# Altium project ENGG3800S2_DANCEMACHINE_REV2.PrjPcb (part 1 of 2)
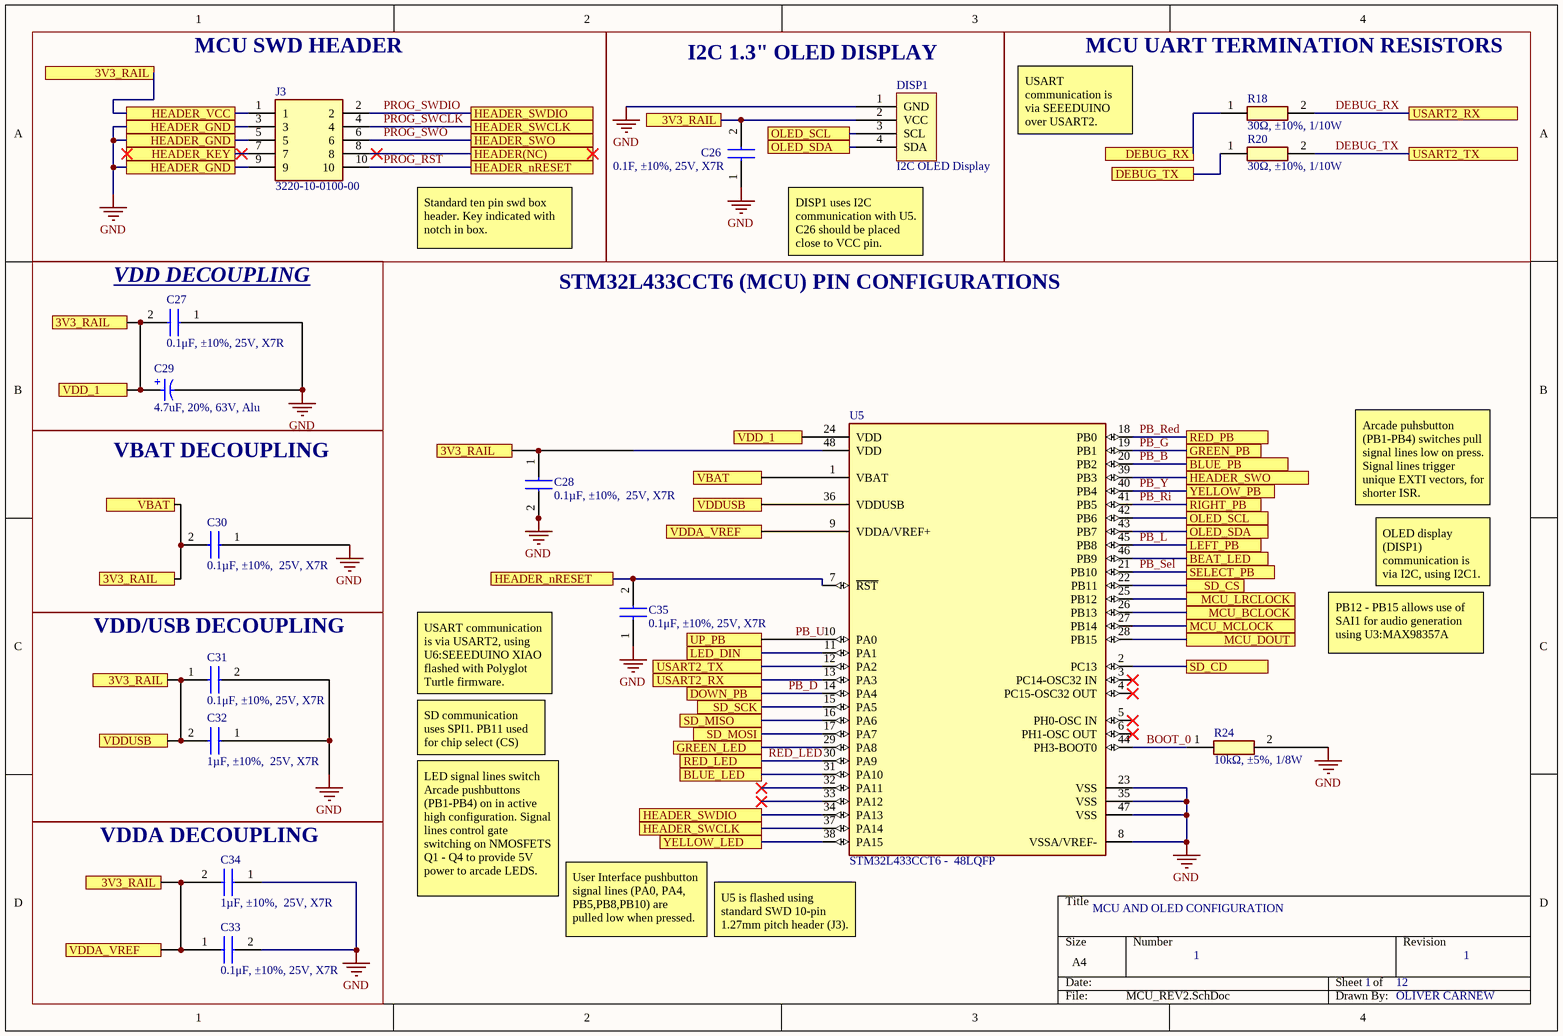
[diagram p0: MCU_REV2.SchDoc]
12 sheets, 293 parts. Net scope: flat (ports and power ports of the same name join across sheets).
Board file: PCB_DANCE_REV2.PcbDoc
Sheets:
  MCU_REV2.SchDoc
  POWER_BATT_REV2.SchDoc
  POWER_REV2.SchDoc
  3.3V_SUPPLY.SchDoc
  AUDIO_REV2.SchDoc
  SD_CARD_REV2.SchDoc
  INTERFACE_rev2.SchDoc
  ARCADE_BUTTONS.SchDoc
  TP_STD_PERIPHERALS.SchDoc
  CONNECTORS_WIRES.SchDoc
  LED_MATRIX.SchDoc
  WIRING_DIAGRAM.SchDoc

## Sheet MCU_REV2.SchDoc
size A4; SheetNumber: 1; SheetTotal: 11

### Parts
C26  0.1F, ±10%, 25V, X7R  [CAPC1005X55N]
C27  0.1μF, ±10%, 25V, X7R  [CAPC1005X55N]
C28  0.1µF, ±10%,  25V, X7R  [CAPC1005X55N]
C29  4.7uF, 20%, 63V, Alu  [WCAP-ATG5_D5H11]
C30  0.1µF, ±10%,  25V, X7R  [CAPC1005X55N]
C31  0.1μF, ±10%, 25V, X7R  [CAPC1005X55N]
C32  1µF, ±10%,  25V, X7R  [CAPC1608X90N]
C33  0.1μF, ±10%, 25V, X7R  [CAPC1005X55N]
C34  1µF, ±10%,  25V, X7R  [CAPC1608X90N]
C35  0.1μF, ±10%, 25V, X7R  [CAPC1005X55N]
DISP1  I2C OLED Display  [OLED_I2C_4pinHEADER]
J3  3220-10-0100-00  [322010010000]
R18  30Ω, ±10%, 1/10W  [RESC1608X55N]
R20  30Ω, ±10%, 1/10W  [RESC1608X55N]
R24  10kΩ, ±5%, 1/8W  [RESC2012X60N]
U5  STM32L433CCT6 -  48LQFP  [FP-LQFP48-5B-MFG]

### Blocks framed on the sheet
MCU SWD HEADER: J3
I2C 1.3" OLED DISPLAY: C26 DISP1
MCU UART TERMINATION RESISTORS: R18 R20
VDD DECOUPLING: C27 C29
VBAT DECOUPLING: C30
VDD/USB DECOUPLING: C31 C32
VDDA DECOUPLING: C33 C34

### Ports
3V3_RAIL, BEAT_LED, BLUE_LED, BLUE_PB, DEBUG_RX, DEBUG_TX, DOWN_PB, GREEN_LED, GREEN_PB, HEADER(NC), HEADER_GND, HEADER_KEY, HEADER_nRESET, HEADER_SWCLK, HEADER_SWDIO, HEADER_SWO, HEADER_VCC, LED_DIN, LEFT_PB, MCU_BCLOCK, MCU_DOUT, MCU_LRCLOCK, MCU_MCLOCK, OLED_SCL, OLED_SDA, RED_LED, RED_PB, RIGHT_PB, SD_CD, SD_CS, SD_MISO, SD_MOSI, SD_SCK, SELECT_PB, UP_PB, USART2_RX, USART2_TX, VBAT, VDD_1, VDDA_VREF, VDDUSB, YELLOW_LED, YELLOW_PB

### Nets
+3V3: C26.2 C27.2 C28.1 C29.1(P) C30.2 C31.1 C32.2 C33.1 C34.2 DISP1.2(VCC) J3.1 U5.1(VBAT) U5.9(VDDA/VREF+) U5.24(VDD) U5.36(VDDUSB) U5.48(VDD) ; port HEADER_VCC, port 3V3_RAIL, port VBAT, port VDDUSB, port VDDA_VREF, port VDD_1
GND: C26.1 C27.1 C28.2 C29.2(N) C30.1 C31.2 C32.1 C33.2 C34.1 C35.1 DISP1.1(GND) J3.3 J3.5 J3.9 R24.2 U5.8(VSSA/VREF-) U5.23(VSS) U5.35(VSS) U5.47(VSS) ; port HEADER_GND
BOOT_0: R24.1 U5.44(PH3-BOOT0)
DEBUG_RX: R18.2 U5.13(PA3) ; port USART2_RX
DEBUG_TX: R20.2 U5.12(PA2) ; port USART2_TX
LED_B: U5.31(PA10) ; port BLUE_LED
LED_G: U5.29(PA8) ; port GREEN_LED
LED_Y: U5.38(PA15) ; port YELLOW_LED
PB_B: U5.20(PB2) ; port BLUE_PB  [project net BLUE_PB]
PB_D: U5.14(PA4) ; port DOWN_PB
PB_G: U5.19(PB1) ; port GREEN_PB  [project net GREEN_PB]
PB_L: U5.45(PB8) ; port LEFT_PB
PB_Red: U5.18(PB0) ; port RED_PB
PB_Ri: U5.41(PB5) ; port RIGHT_PB
PB_Sel: U5.21(PB10) ; port SELECT_PB
PB_U: U5.10(PA0) ; port UP_PB
PB_Y: U5.40(PB4) ; port YELLOW_PB
PROG_RST: C35.2 J3.10 U5.7(~{RST}) ; port HEADER_nRESET
PROG_SWCLK: J3.4 U5.37(PA14) ; port HEADER_SWCLK
PROG_SWDIO: J3.2 U5.34(PA13) ; port HEADER_SWDIO
PROG_SWO: J3.6 U5.39(PB3) ; port HEADER_SWO
RED_LED: U5.30(PA9) ; port RED_LED  [project net LED_R]
SD_CD: U5.2(PC13) ; port SD_CD
SD_CS: U5.22(PB11) ; port SD_CS
SD_MISO: U5.16(PA6) ; port SD_MISO
SD_SCK: U5.15(PA5) ; port SD_SCK
NetDISP1_3: DISP1.3(SCL) U5.42(PB6) ; port OLED_SCL
NetDISP1_4: DISP1.4(SDA) U5.43(PB7) ; port OLED_SDA
NetJ3_7: J3.7 ; port HEADER_KEY
NetJ3_8: J3.8 ; port HEADER(NC)
NetJ4#1_2: U5.11(PA1) ; port LED_DIN
NetR18_1: R18.1 ; port DEBUG_RX
NetR20_1: R20.1 ; port DEBUG_TX
NetR23_2: U5.46(PB9) ; port BEAT_LED
NetR31_1: U5.17(PA7) ; port SD_MOSI
NetU3_1: U5.28(PB15) ; port MCU_DOUT
NetU3_14: U5.25(PB12) ; port MCU_LRCLOCK
NetU3_16: U5.26(PB13) ; port MCU_BCLOCK
NetU5_27: U5.27(PB14) ; port MCU_MCLOCK

Not connected (* = marked no-connect by the designer): U5 3(PC14-OSC32_IN)* 4(PC15-OSC32_OUT)* 5(PH0-OSC_IN)* 6(PH1-OSC_OUT)* 32(PA11)* 33(PA12)*

### Notes on the sheet
- USART communication is via SEEEDUINO over USART2.
- Standard ten pin swd box header. Key indicated with notch in box.
- DISP1 uses I2C communication with U5. C26 should be placed close to VCC pin.
- STM32L433CCT6 (MCU) PIN CONFIGURATIONS
- Arcade puhsbutton (PB1-PB4) switches pull signal lines low on press. Signal lines trigger unique EXTI vectors, for shorter ISR.
- OLED display (DISP1) communication is via I2C, using I2C1.
- PB12 - PB15 allows use of SAI1 for audio generation using U3:MAX98357A
- USART communication is via USART2, using U6:SEEEDUINO XIAO flashed with Polyglot Turtle firmware.
- SD communication uses SPI1. PB11 used for chip select (CS)
- LED signal lines switch Arcade pushbuttons (PB1-PB4) on in active high configuration. Signal lines control gate switching on NMOSFETS Q1 - Q4 to provide 5V power to arcade LEDS.
- MCU AND OLED CONFIGURATION
- User Interface pushbutton signal lines (PA0, PA4, PB5,PB8,PB10) are pulled low when pressed.
- (near U5) U5 is flashed using standard SWD 10-pin 1.27mm pitch header (J3).
- 1
- 12
- OLIVER CARNEW
- (in symbol CMP-03913-53914231-1) +

### Library data of the parts
C26-C28 C30 C31 C33 C35 = CL05B104KA5NNNC: Capacitor CAP CER 0.1UF 25V X7R 0402 CL05B104KA5NNNC; Manufacturer_Name: SAMSUNG; Datasheet Link: https://datasheet.datasheetarchive.com/originals/distributors/DKDS-19/372989.pdf; Height: 0.55mm; Manufacturer_Part_Number: CL05B104KA5NNNC; Mouser Part Number: 187-CL05B104KA5NNNC; Mouser Price/Stock: https://www.mouser.co.uk/ProductDetail/Samsung-Electro-Mechanics/CL05B104KA5NNNC?qs=Efv9o2T6U88DLyyMSzjXSQ%3D%3D; Arrow Part Number: CL05B104KA5NNNC; Arrow Price/Stock: https://www.arrow.com/en/products/cl05b104ka5nnnc/samsung-electro-mechanics?region=nac; Parameter 1: Capacitor CAP CER 0.1UF 25V X7R 0402 CL05B104KA5NNNC
C29 = CMP-03913-53914231-1: 860020672008 WCAP-ATG5 Aluminum Electrolytic Capacitors860020672008; Pitch: 2mm; Ripple Current: 32mA; Voltage Rating: 50V; Life (Hours): 2000hours; Leakage Current: 3µA; Capacitance: 4.7µF; Polarity: Polar; Min Operating Temperature: -40°C; Case/Package: Radial; Packaging: Tape & Box (TB); Tolerance: 20%; Height: 11mm; Lead Pitch: 2.0066mm; Diameter: 5mm; NexarPartId: 53914231; REACH SVHC: Unknown; Voltage Rating (DC): 50V; Mount: Through Hole; Height - Seated (Max): 12.4968mm; Length: 11mm; Max Operating Temperature: 105°C; RoHS: Compliant
C32 C34 = CL10B105KA8NNNC: Capacitor 1 µF ±10% 25V Ceramic Capacitor X7R 0603 (1608 Metric) CL10B105KA8NNNC; Manufacturer_Name: SAMSUNG; Datasheet Link: https://datasheet.datasheetarchive.com/originals/distributors/Datasheets-DGA10/2410489.pdf; Height: 0.9mm; Manufacturer_Part_Number: CL10B105KA8NNNC; Mouser Part Number: 187-CL10B105KA8NNNC; Mouser Price/Stock: https://www.mouser.co.uk/ProductDetail/Samsung-Electro-Mechanics/CL10B105KA8NNNC?qs=349EhDEZ59qp%252BMgnTol5Nw%3D%3D; Arrow Part Number: CL10B105KA8NNNC; Arrow Price/Stock: https://www.arrow.com/en/products/cl10b105ka8nnnc/samsung-electro-mechanics?region=nac; Parameter 1: 1 µF ±10% 25V Ceramic Capacitor X7R 0603 (1608 Metric)
DISP1 = OLED_I2C_4pinHEADER: OLED_I2C_4pinHEADER Large clear space
J3 = 3220-10-0100-00: Connector; Manufacturer_Name: CNC Tech; Datasheet Link: https://datasheet.datasheetarchive.com/originals/dk/DKDS-7/133059.pdf; Height: 5.6mm; Manufacturer_Part_Number: 3220-10-0100-00; Arrow Part Number: 3220-10-0100-00; Arrow Price/Stock: https://www.arrow.com/en/products/3220-10-0100-00/cnc-tech-llc?utm_currency=USD&region=nac
R18 R20 = ERJPA3F30R0V: Resistor ERJPA3F30R0V 30 Ohms ±1% 0.333W, 1/3W Chip Resistor 0603 (1608 Metric) Automotive AEC-Q200, Pulse Withstanding Thick Film; Manufacturer_Name: Panasonic; Datasheet Link: https://industrial.panasonic.com/cdbs/www-data/pdf/RDA0000/AOA0000C243.pdf; Height: 0.55mm; Manufacturer_Part_Number: ERJPA3F30R0V; Arrow Part Number: ERJPA3F30R0V; Arrow Price/Stock: https://www.arrow.com/en/products/erj-pa3f30r0v/panasonic; Parameter 1: Resistor ERJPA3F30R0V 30 Ohms ±1% 0.333W, 1/3W Chip Resistor 0603 (1608 Metric) Automotive AEC-Q200, Pulse Withstanding Thick Film
R24 = RC0805JR-0710KL: Resistor RES 10K OHM 5% 1/8W 0805  RC0805JR-0710KL; Manufacturer_Name: YAGEO; Datasheet Link: https://componentsearchengine.com/Datasheets/2/RC0805JR-0710KL.pdf; Height: 0.6mm; Manufacturer_Part_Number: RC0805JR-0710KL; Mouser Part Number: 603-RC0805JR-0710KL; Mouser Price/Stock: https://www.mouser.co.uk/ProductDetail/YAGEO/RC0805JR-0710KL?qs=ZFGQJeMQzF5q%2Fp77vM%2FrVQ%3D%3D; Arrow Part Number: RC0805JR-0710KL; Arrow Price/Stock: https://www.arrow.com/en/products/rc0805jr-0710kl/yageo?region=nac
U5 = CMP-12105-000047-1: IC MCU 32BIT 256KB FLASH 48LQFP; Manufacturer: STMicroelectronics; Max Junction Temp: +105°C; Min Supply Voltage: 1.55V; Number Of Uart Channels: 4; Number Of I2C Channels: 3; Max Supply Voltage: 3.6V; Number Of I/Os: 38; Number Of Usb Channels: 1; Memory Size: 256KBytes; Interface: I2C,SPI,UART,USART,CAN,USB,LIN,IrDA,SMBus,Other; Ram Size: 64KBytes; Standoff Height: 0.05mm; Number Of Pwm Channels: 14; Number Of Timers/Counters: 9; Frequency: 80MHz; Data Bus Width: 32bits; Number Of Adc Channels: 10; Core Architecture: Arm Cortex-M4; Digikey Description: IC MCU 32BIT 256KB FLASH 48LQFP; Category: IC; Ambient Temperature Range High: +85°C; Number Of Spi Channels: 3; Temperature Range High: +85°C; ComponentLink2Description: Datasheet; Device Class L3: Microcontrollers; Device Class L2: Embedded Processors and Controllers; Temperature Range Low: -40°C; Ambient Temperature Range Low: -40°C; Manufacturer Part Number: STM32L433CCT6; Automotive: No; Package: LQFP48-5B; Ipc Land Pattern Name: QFP50P900X900X160-48; RoHS: TRUE; Octopart: https://octopart.com/stm32l433cct6-stmicroelectronics-71093511; Number Of A/D Converters: 1; Memory Type: FLASH; Lead Free: Yes; ComponentLink2URL: https://www.st.com/resource/en/datasheet/stm32l433cc.pdf; Device Class L1: Integrated Circuits (ICs); Temperature: -40°C to +85°C; Number Of Cores: 1; Height: 1.6mm

## Sheet POWER_BATT_REV2.SchDoc
size A4; SheetNumber: 2; SheetTotal: 11
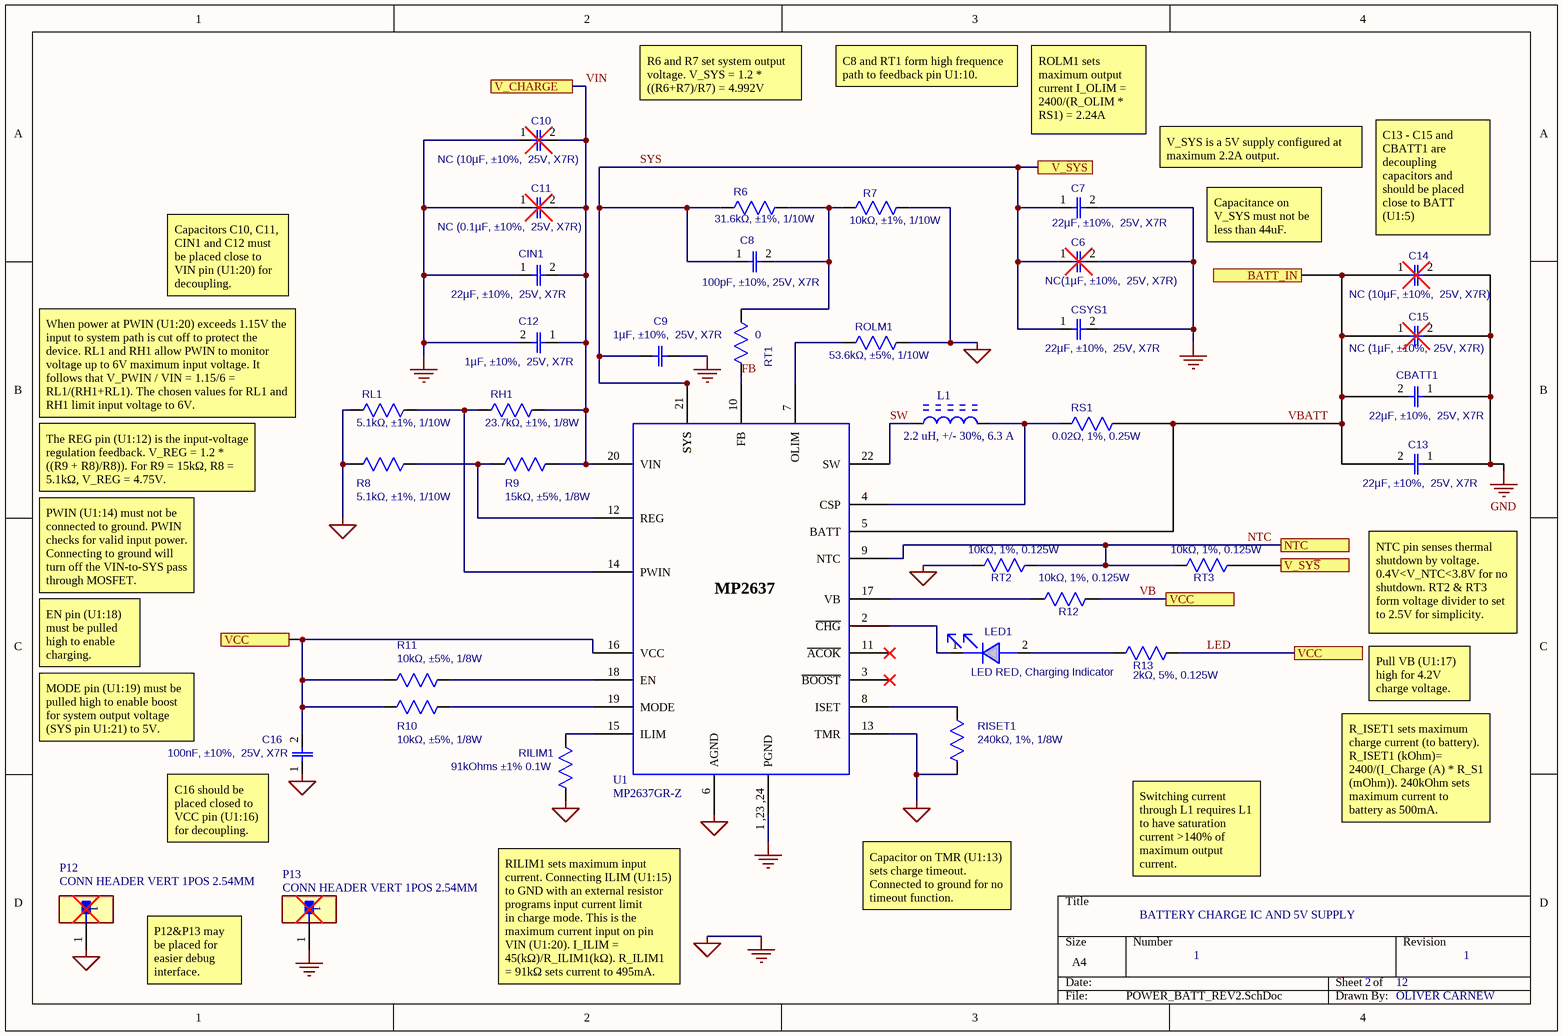
[diagram p1: POWER_BATT_REV2.SchDoc]

### Parts
(Parts that share a designator on the sheet are numbered #1, #2 ... from top to bottom, then left to right.)
*#1  NC  (value not drawn)
*#2  NC  (value not drawn)
*#3  NC  (value not drawn)
*?#1  NC  (value not drawn)
*?#2  NC  (value not drawn)
*?#3  NC  (value not drawn)
*?#4  NC  (value not drawn)
C6  NC(1µF, ±10%,  25V, X7R)  [CAP/0603]
C7  22µF, ±10%,  25V, X7R  [CAP/1206]
C8  100pF, ±10%, 25V, X7R  [CAP/0603]
C9  1µF, ±10%,  25V, X7R  [CAP/0603]
C10  NC (10µF, ±10%,  25V, X7R)  [CAP/0603]
C11  NC (0.1µF, ±10%,  25V, X7R)  [CAP/1206]
C12  1µF, ±10%,  25V, X7R  [CAP/0603]
C13  22µF, ±10%,  25V, X7R  [CAP/1206]
C14  NC (10µF, ±10%,  25V, X7R)  [CAP/0603]
C15  NC (1µF, ±10%,  25V, X7R)  [CAP/1206]
C16  100nF, ±10%,  25V, X7R  [CAP/0603]
CBATT1  22µF, ±10%,  25V, X7R  [CAP/1206]
CIN1  22µF, ±10%,  25V, X7R  [CAP/1206]
CSYS1  22µF, ±10%,  25V, X7R  [CAP/1206]
L1  2.2 uH, +/- 30%, 6.3 A  [BOUR-SRN8040_V]
LED1  LED RED, Charging Indicator  [LED/SMD/0805]
P12  CONN HEADER VERT 1POS 2.54MM  [FP-PH1-01-UA-MFG]
P13  CONN HEADER VERT 1POS 2.54MM  [FP-PH1-01-UA-MFG]
R6  31.6kΩ, ±1%, 1/10W  [RES/0603]
R7  10kΩ, ±1%, 1/10W  [RES/0603]
R8  5.1kΩ, ±1%, 1/10W  [RES/0603]
R9  15kΩ, ±5%, 1/8W  [RES/0603]
R10  10kΩ, ±5%, 1/8W  [RES/0603]
R11  10kΩ, ±5%, 1/8W  [RES/0603]
R12  10kΩ, 1%, 0.125W  [RES/0603]
R13  2kΩ, 5%, 0.125W  [RES/0603]
RH1  23.7kΩ, ±1%, 1/8W  [RES/0603]
RILIM1  91kOhms ±1% 0.1W  [RES/0603]
RISET1  240kΩ, 1%, 1/8W  [RES/0603]
RL1  5.1kΩ, ±1%, 1/10W  [RES/0603]
ROLM1  53.6kΩ, ±5%, 1/10W  [RES/0603]
RS1  0.02Ω, 1%, 0.25W  [RES/1206]
RT1  value 0  [RES/0603]  (hidden comment: RES/0603)
RT2  10kΩ, 1%, 0.125W  [RES/0603]
RT3  10kΩ, 1%, 0.125W  [RES/0603]
U1  MP2637GR-Z  [QFN24/4X4]

### Ports
BATT_IN, NTC, V_CHARGE, V_SYS, V_SY~{S}, VCC

### Nets
GND: C6.2 C7.2 C9.1 C10.1 C11.1 C12.2 C13.1 C14.2 C15.2 C16.1 CBATT1.1 CIN1.1 CSYS1.2 P12.1 P13.1 R7.1 R8.1 RILIM1.1 RISET1.1 RL1.1 ROLM1.1 RT2.2 U1.1_,23_,24(PGND) U1.6(AGND) U1.13(TMR)  [also labelled PGND]
FB: RT1.2 U1.10(FB)
LED: C16.2 R10.2 R11.2 R12.2 R13.1 U1.16(VCC) ; port VCC  [also labelled VB]
NTC: RT2.1 RT3.2 U1.9(NTC) ; port NTC
SW: L1.1 U1.22(SW)
SYS: C6.1 C7.1 C8.1 C9.2 CSYS1.1 R6.2 U1.21(SYS) U1.22(SYS) ; port V_SYS
VBATT: C13.2 C14.1 C15.1 CBATT1.2 RS1.1 U1.5(BATT) ; port BATT_IN  [project net V_BATT]
VIN: C10.2 C11.2 C12.1 CIN1.2 R9.2 RH1.2 U1.20(VIN) ; port V_CHARGE
NetC8_2: C8.2 R6.1 R7.2 RT1.1
NetL1_2: L1.2 RS1.2 U1.4(CSP)
NetLED1_1: LED1.1 U1.2(~{CHG})
NetLED1_2: LED1.2 R13.2
NetR8_2: R8.2 R9.1 U1.12(REG)
NetR10_1: R10.1 U1.19(MODE)
NetR11_1: R11.1 U1.18(EN)
NetR12_1: R12.1 U1.17(VB)
NetRH1_1: RH1.1 RL1.2 U1.14(PWIN)
NetRILIM1_2: RILIM1.2 U1.15(ILIM)
NetRISET1_2: RISET1.2 U1.8(ISET)
NetROLM1_2: ROLM1.2 U1.7(OLIM)
NetRT3_1: RT3.1 ; port V_SY~{S}

Not connected (* = marked no-connect by the designer): U1 3(~{BOOST})* 11(~{ACOK})*

### Notes on the sheet
- R6 and R7 set system output voltage. V_SYS = 1.2 * ((R6+R7)/R7) = 4.992V
- C8 and RT1 form high frequence path to feedback pin U1:10.
- ROLM1 sets maximum output current I_OLIM = 2400/(R_OLIM * RS1) = 2.24A
- V_SYS is a 5V supply configured at maximum 2.2A output.
- Capacitance on V_SYS must not be less than 44uF.
- C13 - C15 and CBATT1 are decoupling capacitors and should be placed close to BATT (U1:5)
- Capacitors C10, C11, CIN1 and C12 must be placed close to VIN pin (U1:20) for decoupling.
- When power at PWIN (U1:20) exceeds 1.15V the input to system path is cut off to protect the device. RL1 and RH1 allow PWIN to monitor voltage up to 6V maximum input voltage. It follows that V_PWIN / VIN = 1.15/6 = RL1/(RH1+RL1). The chosen values for RL1 and RH1 limit input voltage to 6V.
- The REG pin (U1:12) is the input-voltage regulation feedback. V_REG = 1.2 * ((R9 + R8)/R8)). For R9 = 15kΩ, R8 = 5.1kΩ, V_REG = 4.75V.
- PWIN (U1:14) must not be connected to ground. PWIN checks for valid input power. Connecting to ground will turn off the VIN-to-SYS pass through MOSFET.
- NTC pin senses thermal shutdown by voltage. 0.4V<V_NTC<3.8V for no shutdown. RT2 & RT3 form voltage divider to set to 2.5V for simplicity.
- EN pin (U1:18) must be pulled high to enable charging.
- Pull VB (U1:17) high for 4.2V charge voltage.
- MODE pin (U1:19) must be pulled high to enable boost for system output voltage (SYS pin U1:21) to 5V.
- (near C16) C16 should be placed closed to VCC pin (U1:16) for decoupling.
- R_ISET1 sets maximum charge current (to battery). R_ISET1 (kOhm)= 2400/(I_Charge (A) * R_S1 (mOhm)). 240kOhm sets maximum current to battery as 500mA.
- Capacitor on TMR (U1:13) sets charge timeout. Connected to ground for no timeout function.
- Switching current through L1 requires L1 to have saturation current >140% of maximum output current.
- BATTERY CHARGE IC AND 5V SUPPLY
- P12&P13 may be placed for easier debug interface.
- RILIM1 sets maximum input current. Connecting ILIM (U1:15) to GND with an external resistor programs input current limit
  in charge mode. This is the maximum current input on pin VIN (U1:20). I_ILIM = 45(kΩ)/R_ILIM1(kΩ). R_ILIM1 = 91kΩ sets current to 495mA.
- 1
- 2
- 12
- OLIVER CARNEW

### Library data of the parts
C6 = 07.0043: Ceramic Capacitor;16V;X7R;0603;; Manufacturer: {Manufacturer}; Manufacturer P/N: {Manufacturer P/N}; Part_Name: GRM188R71C105KA12D; Manufacture: muRata; Pid: 1505; Out_Num: 0; Available_Num: 5801; Note: 1uF/16V; Package: 0603; Part Number: 07.0043; Spec: Ceramic Capacitor; Manufacture_PN: GRM188R71C105KA12D; Stock_Num: 5801
C7 C15 CSYS1 = 07.0581: Ceramic Capacitor;10V;X7R;1206; Manufacturer: {Manufacturer}; Manufacturer P/N: {Manufacturer P/N}; Part_Name: GRM31CR71A226KE15L; Manufacture: muRata; Pid: 2003; Out_Num: 0; Available_Num: 1278; Note: 22uF/10V/1206; Package: 1206; Part Number: 07.0581; Spec: Ceramic Capacitor; Manufacture_PN: GRM31CR71A226KE15L; Stock_Num: 1278
C8 = 07.0138: Ceramic Capacitor;50V;C0G;0603; 100pF; Manufacturer: {Manufacturer}; Manufacturer P/N: {Manufacturer P/N}; Part_Name: C1608C0G1H470J; Manufacture: TDK; Pid: 1600; Out_Num: 0; Available_Num: 5335; Note: 47pF/50V; Package: 0603; Part Number: 07.0138; Spec: Ceramic Capacitor; Manufacture_PN: C1608C0G1H470J; Stock_Num: 5335
C9 = 07.0043: Ceramic Capacitor;16V;X7R;0603;; Manufacturer: {Manufacturer}; Manufacturer P/N: {Manufacturer P/N}; Part_Name: GRM188R71C105KA12D; Manufacture: muRata; Pid: 680; Out_Num: 0; Available_Num: 2297; Package: 0603; Part Number: 07.0043; Spec: Ceramic Capacitor; Manufacture_PN: GRM188R71C105KA12D; Stock_Num: 2297
C10 = 07.0772: Ceramic Capacitor;25V;X7R; Manufacturer: {Manufacturer}; Manufacturer P/N: {Manufacturer P/N}; Part_Name: C1608X7R1E105K; Manufacture: TDK; Pid: 2193; Out_Num: 310; Available_Num: 2930; Note: 1uF/25V; Package: 0603; Part Number: 07.0772; Spec: Ceramic Capacitor; Manufacture_PN: C1608X7R1E105K; Stock_Num: 3240
C11 CIN1 = 07.0752: Ceramic Capacitor;25V;X5R;; Manufacturer: {Manufacturer}; Manufacturer P/N: {Manufacturer P/N}; Part_Name: GRM31CR61E226KE15; Manufacture: Murata; Pid: 2173; Out_Num: 260; Available_Num: 1967; Note: 22uF/25V/1206; Package: 1206; Part Number: 07.0752; Spec: Ceramic Capacitor; Manufacture_PN: GRM31CR61E226KE15; Stock_Num: 2227
C12 = 07.0772: Ceramic Capacitor;25V;X7R; Manufacturer: {Manufacturer}; Manufacturer P/N: {Manufacturer P/N}; Part_Name: C1608X7R1E105K; Manufacture: TDK; Pid: 2193; Out_Num: 0; Note: 1uF/25V; Package: 0603; Part Number: 07.0772; Spec: Ceramic Capacitor; Manufacture_PN: C1608X7R1E105K; Stock_Num: 0; Available_Num: 0
C13 = 07.0581: Ceramic Capacitor;10V;X7R;1206; 22µF, ±10%,  25V, X7R; Manufacturer: {Manufacturer}; Manufacturer P/N: {Manufacturer P/N}; Part_Name: GRM31CR71A226KE15L; Manufacture: muRata; Pid: 1170; Out_Num: 0; Available_Num: 1278; Package: 1206; Part Number: 07.0581; Spec: Ceramic Capacitor; Manufacture_PN: GRM31CR71A226KE15L; Stock_Num: 1278
C14 = 07.0043: Ceramic Capacitor;16V;X7R;0603; NC (22µF, ±10%,  25V, X7R); Manufacturer: {Manufacturer}; Manufacturer P/N: {Manufacturer P/N}; Part_Name: GRM188R71C105KA12D; Manufacture: muRata; Pid: 1505; Out_Num: 0; Available_Num: 5801; Note: 1uF/16V; Package: 0603; Part Number: 07.0043; Spec: Ceramic Capacitor; Manufacture_PN: GRM188R71C105KA12D; Stock_Num: 5801
C16 = 07.0053: Ceramic Capacitor;16V;X7R;0603;100nF, ±10%,  25V, X7R; Manufacturer: {Manufacturer}; Manufacturer P/N: {Manufacturer P/N}; Part_Name: GRM188R71C104KA01D; Manufacture: muRata; Pid: 1515; Out_Num: 1670; Available_Num: 848; Note: 100nF/16V; Package: 0603; Part Number: 07.0053; Spec: Ceramic Capacitor; Manufacture_PN: GRM188R71C104KA01D; Stock_Num: 2518
CBATT1 = 07.0581: Ceramic Capacitor;10V;X7R;1206; Manufacturer: {Manufacturer}; Manufacturer P/N: {Manufacturer P/N}; Part_Name: GRM31CR71A226KE15L; Manufacture: muRata; Pid: 1170; Out_Num: 0; Available_Num: 1278; Package: 1206; Part Number: 07.0581; Spec: Ceramic Capacitor; Manufacture_PN: GRM31CR71A226KE15L; Stock_Num: 1278
L1 = CMP-2000-07144-1: Semi-Shielded Power Inductor, 2.2 uH, +/- 30%, 6.3 A, -40 to 125 degC, 2-Pin SMD, RoHS, Tape and Reel SRN8040-2R2Y; Manufacturer: Bourns; Brand/Series: SRN8040Series; Current, Rating: 6.3A; Inductance: 2.2μH; Type: Power; Datasheet Version: 05/2015; Mounting Technology: SurfaceMount; Tolerance: ±30%; Datasheet URL: http://www.bourns.com/docs/Product-Datasheets/SRN8040.pdf; Package Reference: SRN8040; Termination: SMD; Manufacturer URL: http://www.bourns.com/; Package Description: 2-Pin Surface Mounted Device, Body 8 x 8 mm
LED1 = 19.0003: LED;ºì¹â; LED/SMD/0805; Manufacturer P/N: {Manufacturer P/N}; Manufacturer: {Manufacturer}; Manufacture: BRIGHT LED; Value: BL-HUF35A-TRB; Pid: 37; Out_Num: 0; Available_Num: 1960; Package: 0805; Part Number: 19.0003; Spec: LED; Part_Name: BL-HUF35A-TRB; Manufacture_PN: BL-HUF35A-TRB; Stock_Num: 1960
P12 P13 = CMP-42765-000003-1: CONN HEADER VERT 1POS 2.54MM PH1-01-UA; Number of Positions: 1; Voltage Rating (AC): 250V; Insulation Material: PBT; Number of Rows: 1; Connector Type: Header; Min Operating Temperature: -40°C; Packaging: Bulk; Contact Material: Brass; Mount: Through Hole; Contact Shape: Square; Contact Finish - Mating: GOLD; Series: PH1; Contact Type: Male Pin; Termination: Solder; Flammability Rating: UL94 V-0; Insulation Color: Black; Lead Free: Lead Free; Fastening Type: Pull; Max Operating Temperature: 105°C
R6 = 06.0160: Film Resistor;1%;; Manufacturer: Yageo; Manufacturer P/N: 9C06031A1203FKHFT; Part_Name: RC0603FR-0731K6L; Pid: 2840; Out_Num: 0; Available_Num: 4254; Note: 31.6k/1%; Distributor: Digikey; Package: 0603; Distributor P/N: 311-120KHCT-ND; Part Number: 06.0160; Spec: Film Resistor; Manufacture: Yageo; Manufacture_PN: RC0603FR-0731K6L; Stock_Num: 4254
R7 = 06.0112: Film Resistor;1%;; Manufacturer: Yageo; Manufacturer P/N: 9C06031A1203FKHFT; Part_Name: RC0603FR-0710KL; Pid: 2792; Out_Num: 2310; Available_Num: 7415; Note: 10k/1%; Distributor: Digikey; Package: 0603; Distributor P/N: 311-120KHCT-ND; Part Number: 06.0112; Spec: Film Resistor; Manufacture: Yageo; Manufacture_PN: RC0603FR-0710KL; Stock_Num: 9725
R8 RL1 = 06.0691: Film Resistor;1%;; Manufacturer: Yageo; Manufacturer P/N: 9C06031A1203FKHFT; Part_Name: RC0603FR-075K1L; Pid: 3353; Out_Num: 0; Available_Num: 5749; Note: 5.1k/1%; Distributor: Digikey; Package: 0603; Distributor P/N: 311-120KHCT-ND; Part Number: 06.0691; Spec: Film Resistor; Manufacture: Yageo; Manufacture_PN: RC0603FR-075K1L; Stock_Num: 5749
R9 = 06.0129: Film Resistor;1%;; Manufacturer: Yageo; Manufacturer P/N: 9C06031A1203FKHFT; Part_Name: RC0603FR-0715KL; Pid: 2809; Out_Num: 160; Available_Num: 3939; Note: 15k/1%; Distributor: Digikey; Package: 0603; Distributor P/N: 311-120KHCT-ND; Part Number: 06.0129; Spec: Film Resistor; Manufacture: Yageo; Manufacture_PN: RC0603FR-0715KL; Stock_Num: 4099
R10 = 06.0284: Film Resistor;5%;; Manufacturer: Yageo; Manufacturer P/N: 9C06031A1203FKHFT; Part_Name: RC0603JR-0710K; Pid: 2947; Out_Num: 0; Available_Num: 6218; Note: 10k; Distributor: Digikey; Package: 0603; Distributor P/N: 311-120KHCT-ND; Part Number: 06.0284; Spec: Film Resistor; Manufacture: Yageo; Manufacture_PN: RC0603JR-0710K; Stock_Num: 6218
R11 = 06.0284: Manufacturer: Yageo; Manufacturer P/N: 9C06031A1203FKHFT; Part_Name: RC0603JR-0710K; Pid: 2947; Spec: Film Resistor; Out_Num: 0; Available_Num: 6218; Note: 10k; Distributor: Digikey; Package: 0603; Distributor P/N: 311-120KHCT-ND; Part Number: 06.0284; Manufacture: Yageo; Manufacture_PN: RC0603JR-0710K; Stock_Num: 6218
R12 = 06.0284: Film Resistor;5%; 10kΩ, 1%, 0.125W; 0603; Manufacturer: Yageo; Manufacturer P/N: 9C06031A1203FKHFT; Part_Name: RC0603JR-0710K; Pid: 2947; Out_Num: 0; Available_Num: 6218; Note: 10k; Distributor: Digikey; Package: 0603; Distributor P/N: 311-120KHCT-ND; Part Number: 06.0284; Spec: Film Resistor; Manufacture: Yageo; Manufacture_PN: RC0603JR-0710K; Stock_Num: 6218
R13 = 06.0015: Film Resistor;5%;1/10W; 5kΩ, 5%, 0.125W 0603; Manufacturer: Yageo; Manufacturer P/N: 9C06031A1203FKHFT; Part_Name: CR0603JA0202G; Manufacture: LIZ; Pid: 2695; Out_Num: 0; Available_Num: 3523; Note: 2K; Distributor: Digikey; Package: 0603; Distributor P/N: 311-120KHCT-ND; Part Number: 06.0015; Spec: Film Resistor; Manufacture_PN: CR0603JA0202G; Stock_Num: 3523
RH1 = 06.0148: Film Resistor;1%; Manufacturer: Yageo; Manufacturer P/N: 9C06031A1203FKHFT; Part_Name: RC0603FR-0723K7L; Pid: 2828; Out_Num: 0; Available_Num: 7686; Note: 23.7k/1%; Distributor: Digikey; Package: 0603; Distributor P/N: 311-120KHCT-ND; Part Number: 06.0148; Spec: Film Resistor; Manufacture: Yageo; Manufacture_PN: RC0603FR-0723K7L; Stock_Num: 7686
RILIM1 = 06.0129: 91 kOhms ±1% 0.1W, 1/10W Chip Resistor 0603 (1608 Metric) Anti-Sulfur Thin FilmMCT06030C9102FP500; Manufacturer: Yageo; Manufacturer P/N: 9C06031A1203FKHFT; Part_Name: RC0603FR-0715KL; Value: 15K 1%; Pid: 2809; Spec: Film Resistor; Out_Num: 0; Available_Num: 1229; Note: 15k/1%; Distributor: Digikey; Package: 0603; Distributor P/N: 311-120KHCT-ND; Part Number: 06.0129; Manufacture: Yageo; Manufacture_PN: RC0603FR-0715KL; Stock_Num: 1229
RISET1 = 06.0177: Film Resistor;1%; 240kΩ, 1%, 1/8W; Manufacturer: Yageo; Manufacturer P/N: 9C06031A1203FKHFT; Part_Name: RC0603FR-0747K5L; Pid: 2857; Out_Num: 0; Available_Num: 7700; Note: 47.5k/1%; Distributor: Digikey; Package: 0603; Distributor P/N: 311-120KHCT-ND; Part Number: 06.0177; Spec: Film Resistor; Manufacture: Yageo; Manufacture_PN: RC0603FR-0747K5L; Stock_Num: 7700
ROLM1 = 06.0182: Film Resistor;1%; Manufacturer: Yageo; Manufacturer P/N: 9C06031A1203FKHFT; Part_Name: RC0603FR-0753K6L; Pid: 2862; Out_Num: 0; Available_Num: 9040; Note: 53.6k/1%; Distributor: Digikey; Package: 0603; Distributor P/N: 311-120KHCT-ND; Part Number: 06.0182; Spec: Film Resistor; Manufacture: Yageo; Manufacture_PN: RC0603FR-0753K6L; Stock_Num: 9040
RS1 = 06.0564: Film Resistor;1%; RES 0.02 OHM 1% 1/4W 1206; WSL1206R0200FEA; Manufacturer: Yageo; Manufacturer P/N: 9C06031A1203FKHFT; Part_Name: WSL1206-18; Manufacture: Vishay; Pid: 3227; Out_Num: 0; Available_Num: 291; Note: 20m/1%/1206; Distributor: Digikey; Package: 1206; Distributor P/N: 311-120KHCT-ND; Part Number: 06.0564; Spec: Film Resistor; Manufacture_PN: WSL1206-18; Stock_Num: 291
RT1 = 06.0039: Film Resistor;5%;; Manufacturer: Yageo; Manufacturer P/N: 9C06031A1203FKHFT; Part_Name: RC0603JR-070RL; Pid: 2719; Out_Num: 4670; Available_Num: 14667; Distributor: Digikey; Package: 0603; Distributor P/N: 311-120KHCT-ND; Part Number: 06.0039; Spec: Film Resistor; Manufacture: Yageo; Manufacture_PN: RC0603JR-070RL; Stock_Num: 19337; Note: 0
RT2 = 06.0112: Film Resistor;1%; 10kΩ, 1%, 0.125W; 0603; Manufacturer: Yageo; Manufacturer P/N: 9C06031A1203FKHFT; Part_Name: RC0603FR-0710KL; Pid: 2792; Out_Num: 2110; Available_Num: 16838; Note: 10k/1%; Distributor: Digikey; Package: 0603; Distributor P/N: 311-120KHCT-ND; Part Number: 06.0112; Spec: Film Resistor; Manufacture: Yageo; Manufacture_PN: RC0603FR-0710KL; Stock_Num: 18948
RT3 = 06.0112: Film Resistor;1%; 10kΩ, 1%, 0.125W;0603; Manufacturer: Yageo; Manufacturer P/N: 9C06031A1203FKHFT; Part_Name: RC0603FR-0710KL; Pid: 2792; Out_Num: 2110; Available_Num: 16838; Note: 10k/1%; Distributor: Digikey; Package: 0603; Distributor P/N: 311-120KHCT-ND; Part Number: 06.0112; Spec: Film Resistor; Manufacture: Yageo; Manufacture_PN: RC0603FR-0710KL; Stock_Num: 18948
U1 = MP2637

## Sheet POWER_REV2.SchDoc
size A4; SheetNumber: 3; SheetTotal: 11; SPICEModelCacheNVXGRYFH: <root> / <DocumentId>NVXGRYFH</DocumentId> / </root>
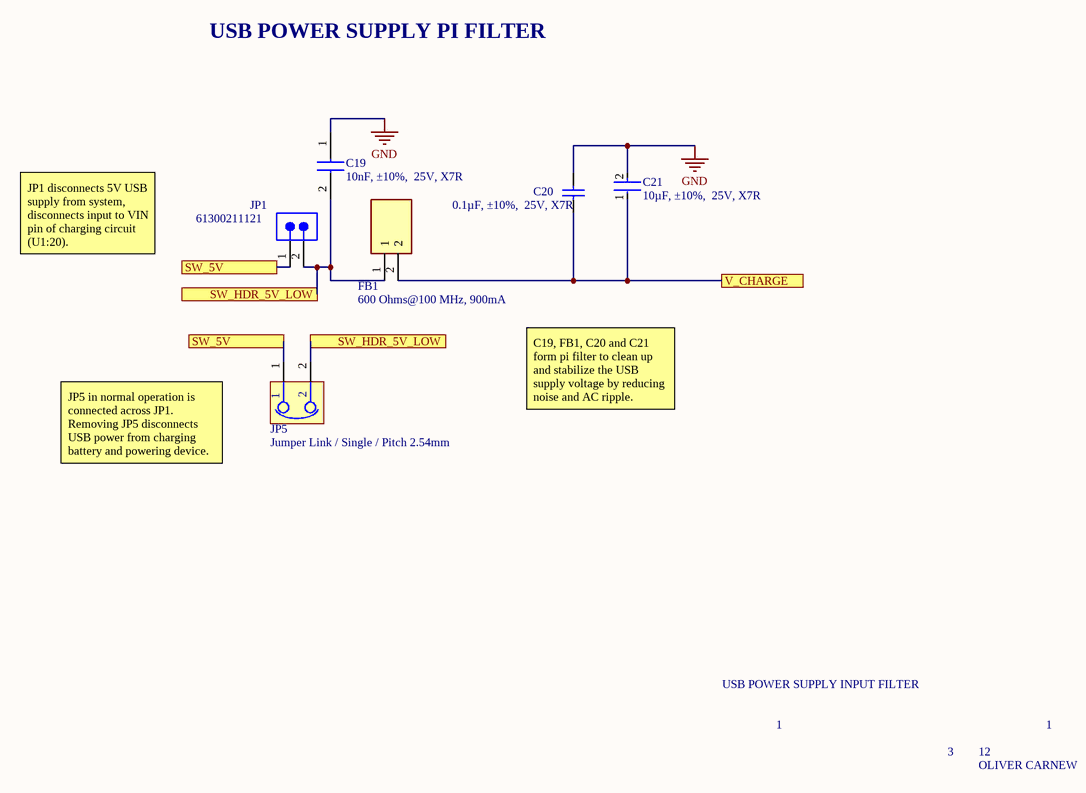
[diagram p2: POWER_REV2.SchDoc]

### Parts
C19  10nF, ±10%,  25V, X7R  [C0603]
C20  0.1µF, ±10%,  25V, X7R  [CAPC1608X90X35ML10T15]
C21  10µF, ±10%,  25V, X7R  [FP-CL21B106KOQNNNE-MFG]
FB1  600 Ohms@100 MHz, 900mA  [BEADC1608X90N]
JP1  61300211121  [61300211121]
JP5  Jumper Link / Single / Pitch 2.54mm

### Ports
SW_5V, SW_HDR_5V_LOW, V_CHARGE

### Nets
GND: C19.1 C20.2 C21.2
VIN: C20.1 C21.1 FB1.2 ; port V_CHARGE
NetC19_2: C19.2 FB1.1 JP1.2 JP5.2 ; port SW_HDR_5V_LOW
NetJP1_1: JP1.1 JP5.1 ; port SW_5V

### Notes on the sheet
- USB POWER SUPPLY PI FILTER
- JP1 disconnects 5V USB supply from system, disconnects input to VIN pin of charging circuit (U1:20).
- C19, FB1, C20 and C21 form pi filter to clean up and stabilize the USB supply voltage by reducing noise and AC ripple.
- JP5 in normal operation is connected across JP1. Removing JP5 disconnects USB power from charging battery and powering device.
- USB POWER SUPPLY INPUT FILTER
- 1
- 3
- 12
- OLIVER CARNEW

### Library data of the parts
C19 = C0603C103K4RECTU: Capacitor 10000 pF ±10% 16V Ceramic Capacitor X7R 0603 (1608 Metric) ETSG 64-12-01 C0603C103K4RECTU; Manufacturer_Name: KEMET; Datasheet Link: https://content.kemet.com/datasheets/KEM_C1090_X7R_ESD.pdf; Height: 0.87mm; Manufacturer_Part_Number: C0603C103K4RECTU; Mouser Part Number: 80-C0603C103K4RECTU; Mouser Price/Stock: https://www.mouser.co.uk/ProductDetail/KEMET/C0603C103K4RECTU?qs=55YtniHzbhDzGaFFpCm8vg%3D%3D; Arrow Part Number: C0603C103K4RECTU; Arrow Price/Stock: https://www.arrow.com/en/products/c0603c103k4rectu/kemet-corporation?region=nac
C20 = CMP-2100-03643-1: Chip Capacitor, 0.1 uF, +/- 10%, 50 V, -55 to 125 degC, 0603 (1608 Metric), RoHS, Tape and Reel; Manufacturer: Murata; Dielectric Material: Ceramic; Voltage Rating: 50V; Capacitance: 100nF; Insulation Resistance: 10GR; Case Code (Metric): 1608; Lead Free: LeadFree; Depth: 0.8mm; Number of Pins: 2; Radiation Hardening: No; Case/Package: 0603; Manufacturer URL: http://www.murata.com/; Packaging: TapeandReel; Length: 1.6mm; Contact Plating: Tin; Datasheet URL: http://psearch.en.murata.com/capacitor/product/GRM188R71H104KA93%23.pdf; Tolerance: 10%; Case Code (Imperial): 0603; Min Operating Temperature: -55degC; RoHSCompliant: true; Voltage: 50V; Termination: SMD/SMT; Mount: SurfaceMount; Material: Ceramic; Package Quantity: 1; Dielectric: X7R; Height: 0.8mm; Thickness: 0.035inch; REACH SVHC: NoSVHC; Max Operating Temperature: 125degC; Width: 0.8mm; Package Reference: 0603; Voltage Rating (DC): 50V; Datasheet Version: 42675.0; Package Description: 2-Pin Surface Mount Device, Body 1.6 x 0.8 mm
C21 = CMP-2000-06106-2: CAP CER 10UF 16V X7R 0805 CL21B106KOQNNNE; Manufacturer: Samsung Electro-Mechanics America, Inc; Material: Ceramic; Temperature Coefficient: 15%; Digikey Description: CAP CER 10UF 16V X7R 0805; Lead Free: Yes; ComponentLink2URL: http://www.samsungsem.com/servlet/FileDownload?path=productsearch&sname=CL21B106KOQNNNE.pdf&oname=CL21B106KOQNNNE.pdf; ComponentLink2Description: Datasheet; Temperature Range Low: -55°C; RoHS: TRUE; Category: Cap; Temperature Characteristic: X7R; Manufacturer Part Number: CL21B106KOQNNNE; Automotive: No; Octopart: https://octopart.com/cl21b106koqnnne-samsung-19832289; Device Class L3: Ceramic Capacitors; Temperature Range High: +125°C; Height: 1.4mm; Device Class L2: Capacitors; Voltage Rating: 16V; Value: 10uF; Temperature: -55°C to +125°C; Tolerance: 10%; Device Class L1: Passive Components; Ipc Land Pattern Name: CAPC200125X125; Package: CL21B106KOQNNNE; Capacitance: 10uF
FB1 = FBMH1608HM601-T: 600 Ohms @ 100 MHz 1 Power Line Ferrite Bead 0603 (1608 Metric) 900mA 170mOhm; Manufacturer_Name: TAIYO YUDEN; Datasheet Link: https://componentsearchengine.com/Datasheets/2/FBMH1608HM601-T.pdf; Height: 0.9mm; Manufacturer_Part_Number: FBMH1608HM601-T; Mouser Part Number: 963-FBMH1608HM601-T; Mouser Price/Stock: https://www.mouser.co.uk/ProductDetail/TAIYO-YUDEN/FBMH1608HM601-T?qs=I6KAKw0tg2y6O4cu0afp%252BA%3D%3D; Arrow Part Number: FBMH1608HM601-T; Arrow Price/Stock: https://www.arrow.com/en/products/fbmh1608hm601-t/taiyo-yuden
JP1 = CMP-1712-00002-6: NexarPartId: 20081794; Number of Contacts: 2; Pitch: 2.54mm; Connector Type: Male Pin; Voltage Rating: 250V; Current Rating: 3A; Gender: Male; Contact Resistance: 20mΩ; Height: 8.94mm; Lead Free: Lead Free; Number of Pins: 2; Termination: Through Hole; RoHS: Compliant; Lead Pitch: 2.54mm; REACH SVHC: No SVHC; Housing Material: PBT; Contact Mating Length: 5.9944mm; Min Operating Temperature: -40°C; Orientation: Vertical; Contact Material: Copper; Contact Gender: Male; Max Operating Temperature: 125°C; Number of Rows: 1; Number of Positions: 2; Packaging: Bulk; Contact Plating: Gold; Mount: Through Hole; Color: Black; Operating Supply Voltage: 250V
JP5 = jumper_2.54mm: CONNECTOR : PCB Jumper Link / Single / Pitch 2.54mm / Black /shunt.  01-96-02

## Sheet 3.3V_SUPPLY.SchDoc
size A4; SheetNumber: 4; SheetTotal: 11
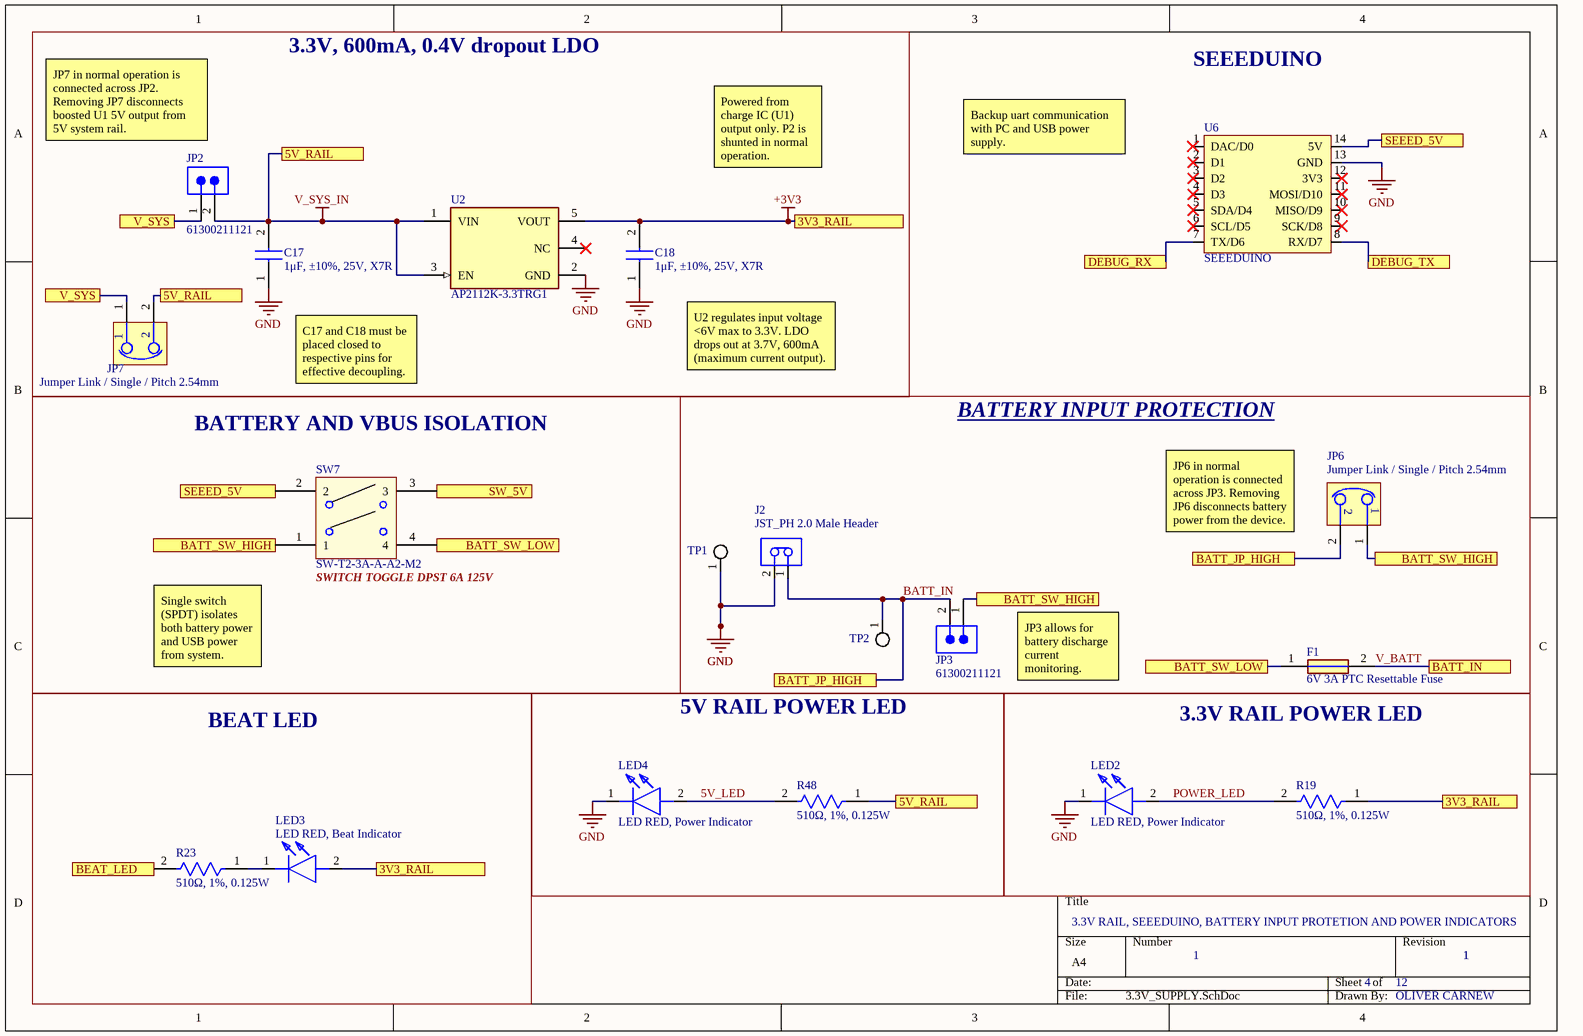
[diagram p3: 3.3V_SUPPLY.SchDoc]

### Parts
(Parts that share a designator on the sheet are numbered #1, #2 ... from top to bottom, then left to right.)
C17  1μF, ±10%, 25V, X7R  [CAPC1608X90N]
C18  1μF, ±10%, 25V, X7R  [CAPC1608X90N]
F1  6V 3A PTC Resettable Fuse  [FUSC4632X155N]
J2#1  JST_PH 2.0 Male Header  [JST-B2B-PH-K-S_V]
JP2  61300211121  [61300211121]
JP3  61300211121  [61300211121]
JP6  Jumper Link / Single / Pitch 2.54mm
JP7  Jumper Link / Single / Pitch 2.54mm
LED2  LED RED, Power Indicator  [LEDC2012X90N]
LED3  LED RED, Beat Indicator  [LEDC2012X90N]
LED4  LED RED, Power Indicator  [LEDC2012X90N]
R19  510Ω, 1%, 0.125W  [FP-CRCW0805-e3-IPC_B]
R23  510Ω, 1%, 0.125W  [FP-CRCW0805-e3-IPC_B]
R48  510Ω, 1%, 0.125W  [FP-CRCW0805-e3-IPC_B]
SW7  SW-T2-3A-A-A2-M2  [SWITCH_PCB_MOUNT]
TP1  Small testpoint 40mil  [TEST_POINT_SMALL]  (value not drawn)
TP2  Small testpoint 40mil  [TEST_POINT_SMALL]  (value not drawn)
U2  AP2112K-3.3TRG1  [FP-SOT25-MFG]
U6  SEEEDUINO  [XIAO - 6mm annular]

### Blocks framed on the sheet
3.3V, 600mA, 0.4V dropout LDO: C17 C18 JP2 JP7 U2
BATTERY AND VBUS ISOLATION: SW7
BATTERY INPUT PROTECTION: F1 J2#1 JP3 JP6 TP1 TP2
BEAT LED: LED3 R23
5V RAIL POWER LED: LED4 R48
3.3V RAIL POWER LED: LED2 R19

### Ports
3V3_RAIL, 5V_RAIL, BATT_IN, BATT_JP_HIGH, BATT_SW_HIGH, BATT_SW_LOW, BEAT_LED, DEBUG_RX, DEBUG_TX, SEEED_5V, SW_5V, V_SYS

### Nets
+3V3: C18.2 LED3.2(A) R19.1 U2.5(VOUT) ; port 3V3_RAIL
GND: C17.1 C18.1 J2#1.2 LED2.1(K) LED4.1(K) TP1.1 U2.2(GND) U6.13(GND)
V_SYS_IN: C17.2 JP2.2 JP7.2 R48.1 U2.1(VIN) U2.3(EN) ; port 5V_RAIL
5V_LED: LED4.2(A) R48.2
BATT_IN: J2#1.1 JP3.2 JP6.2 TP2.1 ; port BATT_JP_HIGH
POWER_LED: LED2.2(A) R19.2
SYS: JP2.1 JP7.1 ; port V_SYS
V_BATT: F1.2 ; port BATT_IN
NetF1_1: F1.1 SW7.4 ; port BATT_SW_LOW
NetJP1_1: SW7.3 ; port SW_5V
NetJP3_1: JP3.1 JP6.1 SW7.1 ; port BATT_SW_HIGH
NetLED3_1: LED3.1(K) R23.1
NetR18_1: U6.7(TX/D6) ; port DEBUG_RX
NetR20_1: U6.8(RX/D7) ; port DEBUG_TX
NetR23_2: R23.2 ; port BEAT_LED
NetSW7_2: SW7.2 U6.14(5V) ; port SEEED_5V

Not connected (* = marked no-connect by the designer): U2 4(NC)*; U6 1(DAC/D0)* 2(D1)* 3(D2)* 4(D3)* 5(SDA/D4)* 6(SCL/D5)* 9(SCK/D8)* 10(MISO/D9)* 11(MOSI/D10)* 12(3V3)*

### Notes on the sheet
- SEEEDUINO
- JP7 in normal operation is connected across JP2. Removing JP7 disconnects boosted U1 5V output from 5V system rail.
- Powered from charge IC (U1) output only. P2 is shunted in normal operation.
- Backup uart communication with PC and USB power supply.
- C17 and C18 must be placed closed to respective pins for effective decoupling.
- U2 regulates input voltage <6V max to 3.3V. LDO drops out at 3.7V, 600mA (maximum current output).
- (near SW7) SWITCH TOGGLE DPST 6A 125V
- (near JP6) JP6 in normal operation is connected across JP3. Removing JP6 disconnects battery power from the device.
- Single switch (SPDT) isolates both battery power and USB power from system.
- JP3 allows for battery discharge current monitoring.
- 3.3V RAIL, SEEEDUINO, BATTERY INPUT PROTETION AND POWER INDICATORS
- 1
- 4
- 12
- OLIVER CARNEW

### Library data of the parts
C17 C18 = CL10B105KA8NNNC: as C32 on sheet MCU_REV2; Datasheet Link: https://datasheet.datasheetarchive.com/originals/distributors/Datasheets-DGA10/2410489.pdf; Height: 0.9mm; Manufacturer_Part_Number: CL10B105KA8NNNC; Mouser Part Number: 187-CL10B105KA8NNNC; Mouser Price/Stock: https://www.mouser.co.uk/ProductDetail/Samsung-Electro-Mechanics/CL10B105KA8NNNC?qs=349EhDEZ59qp%252BMgnTol5Nw%3D%3D; Arrow Part Number: CL10B105KA8NNNC; Arrow Price/Stock: https://www.arrow.com/en/products/cl10b105ka8nnnc/samsung-electro-mechanics?region=nac; Parameter 1: 1 µF ±10% 25V Ceramic Capacitor X7R 0603 (1608 Metric)
F1 = 0ZCG0300FF2B: Polymeric PTC Resettable Fuse 6V 3 A Ih Surface Mount 1812 (4532 Metric), Concave; Manufacturer_Name: BelFuse; Datasheet Link: https://datasheet.datasheetarchive.com/originals/distributors/Datasheets_SAMA/44944b3a27f8483a7253631e04029a1a.pdf; Height: 1.55mm; Manufacturer_Part_Number: 0ZCG0300FF2B; Mouser Part Number: 530-0ZCG0300FF2B; Mouser Price/Stock: https://www.mouser.co.uk/ProductDetail/Bel-Fuse/0ZCG0300FF2B?qs=SRYZG9HaIQ05yXZrpiJOLQ%3D%3D; Arrow Part Number: 0ZCG0300FF2B; Arrow Price/Stock: https://www.arrow.com/en/products/0zcg0300ff2b/bel-group
J2#1 = CMP-2000-05162-1: Male Header, Pitch 2 mm, 1 x 2 Position, Height 6 mm, Tail Length 3.4 mm, -25 to 85 degC, RoHS, Bulk B2B-PH-K-S(LF)(SN); Manufacturer: JST; Pitch: 2mm; Style/Orientation: StraightHeader/Plug; No of Positions: 2; Datasheet Version: Nov-08; Datasheet URL: http://datasheet.octopart.com/B2B-PH-K-S%28LF%29%28SN%29-JST-datasheet-8324864.pdf; Manufacturer URL: http://www.jst.com/home2.html; Type: ShroudedHeader; Termination: Crimp
JP2 JP3 = CMP-1712-00002-6: as JP1 on sheet POWER_REV2; Height: 8.94mm; Lead Free: Lead Free; Number of Pins: 2; Termination: Through Hole; RoHS: Compliant; Lead Pitch: 2.54mm; REACH SVHC: No SVHC; Housing Material: PBT; Contact Mating Length: 5.9944mm; Min Operating Temperature: -40°C; Orientation: Vertical; Contact Material: Copper; Contact Gender: Male; Max Operating Temperature: 125°C; Number of Rows: 1; Number of Positions: 2; Packaging: Bulk; Contact Plating: Gold; Mount: Through Hole; Color: Black; Operating Supply Voltage: 250V
JP6 JP7 = jumper_2.54mm: as JP5 on sheet POWER_REV2
LED2 = MCL-S270SRC: Manufacturer_Name: Multicomp Pro; Datasheet Link: https://www.farnell.com/datasheets/2861594.pdf; Height: 0.9mm; Manufacturer_Part_Number: MCL-S270SRC
LED3 = MCL-S270SRC: LED MCL-S270SRC; Manufacturer_Name: Multicomp Pro; Datasheet Link: https://www.farnell.com/datasheets/2861594.pdf; Height: 0.9mm; Manufacturer_Part_Number: MCL-S270SRC
LED4 = MCL-S270SRC: LED; Manufacturer_Name: Multicomp Pro; Datasheet Link: https://www.farnell.com/datasheets/2861594.pdf; Height: 0.9mm; Manufacturer_Part_Number: MCL-S270SRC
R19 R23 R48 = CMP-2001-03989-2: RES Thick Film, 510Ω, 1%, 0.125W, 100ppm/°C, 0805 CRCW0805510RFKEA; Power Rating: 125mW; Voltage Rating (DC): 150V; Resistance: 510R; Tolerance: 1%; Weight: 0.000194oz; Case Code (Metric): 2012; Packaging: Tape and Reel; Case/Package: 0805; Case Code (Imperial): 0805; Width: 0.049inch; Military Standard: Not; Radiation Hardening: No; Min Operating Temperature: -55°C; Length: 2mm; Termination: SMD/SMT; Max Operating Temperature: 155°C; Height: 0.45mm; Contact Plating: Tin; Lead Free: Lead Free; Voltage Rating: 150V; Composition: Thick Film; Max Power Dissipation: 125mW; Package Quantity: 10; Features: Automotive AEC-Q200; Mount: Surface Mount; Depth: 1.25mm; Temperature Coefficient: 100ppm/°C; Number of Terminations: 2
SW7 = SWITCH_PANEL MOUNT: DPST SWITCH TOGGLE DPST 6A 125V SW-T2-3A-A-A2-M2
TP1 TP2 = TEST_POINT_SMALL: 40mil circular pad no hole
U2 = CMP-12756-000035-1: IC REG LINEAR 3.3V 600MA SOT25 AP2112K-3.3TRG1; Number of Regulators: 1; Output Type: Fixed; Polarity: Positive; Min Input Voltage: 2.5V; Max Input Voltage: 6V; Accuracy: 1.5%; Quiescent Current: 55uA; Dropout Voltage: 250mV; Min Operating Temperature: -40°C; Length: 3.1mm; Output Current: 600mA; Max Operating Temperature: 85°C; Package Quantity: 1; Output Voltage: 3.3V; Width: 1.7mm; Number of Outputs: 1; Packaging: Tape and Reel; Height: 1.3mm; Lead Free: Lead Free; Max Output Current: 600mA; Case/Package: SOT-23-5; Mount: Surface Mount; Number of Pins: 5
U6 = SEEEDUINO: SAMD21 Microcontroller Development Board 0.0327MHz/48MHzCPU 32KB RAM 256KB Flash; Manufacturer: Seeed Studio; Manufacturer Part Number: 102010328; Evaluation Kit: Yes; Core Architecture: ARM; Supplier 1: Digikey; RoHS: No; Category: DSPs - Digital Signal Processors; Stock 1: 2211; Pricing 1: 1=5.4 (USD); Series: SAM D; ComponentLink1URL: https://media.digikey.com/pdf/Data%20Sheets/Seeed%20Technology/102010328_Web.pdf?src-supplier=Digikey; ComponentLink1Description: https://media.digikey.com/pdf/Data%20Sheets/Seeed%20Technology/102010328_Web.pdf?src-supplier=Digikey; Supplier Part Number 1: 1597-102010328-ND

## Sheet AUDIO_REV2.SchDoc
size A4; SheetNumber: 5; SheetTotal: 11
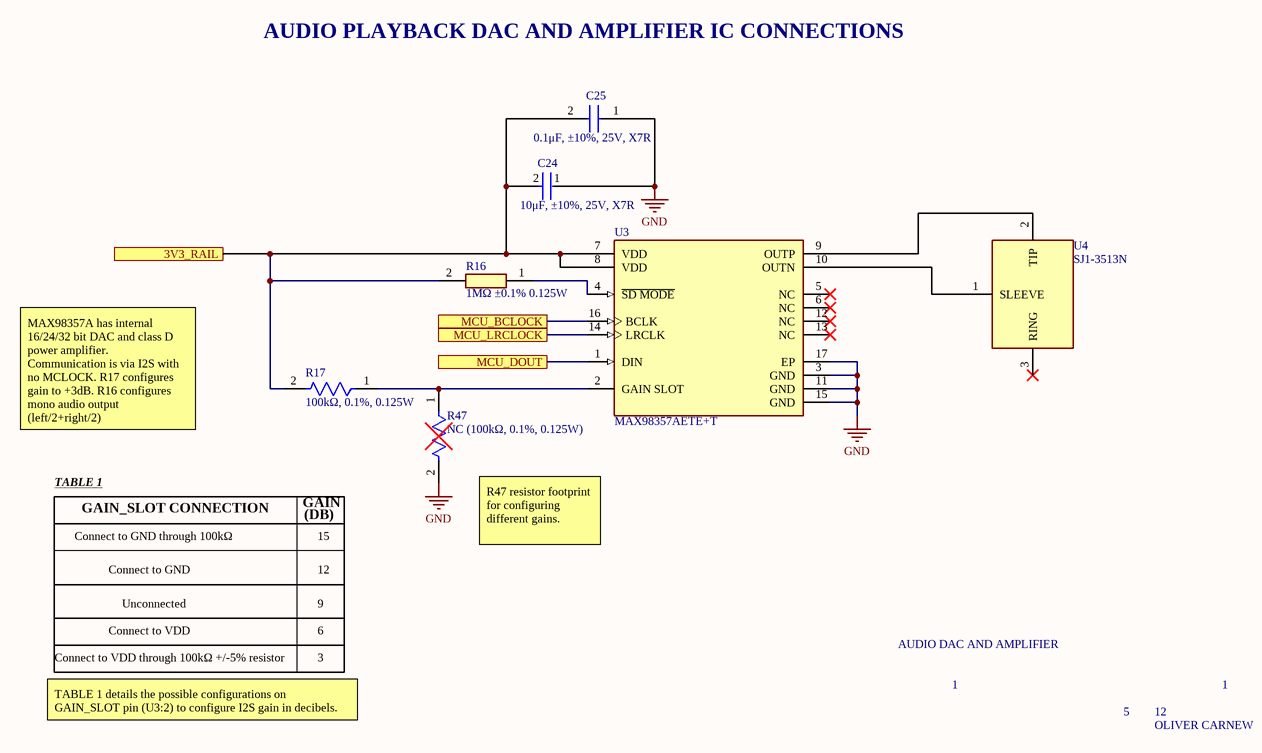
[diagram p4: AUDIO_REV2.SchDoc]

### Parts
(Parts that share a designator on the sheet are numbered #1, #2 ... from top to bottom, then left to right.)
*#4  NC  (value not drawn)
C24  10μF, ±10%, 25V, X7R  [FP-CL21B106KOQNNNE-MFG]
C25  0.1μF, ±10%, 25V, X7R  [CAPC1005X55N]
R16  1MΩ ±0.1% 0.125W  [RESC2012X50N]
R17  100kΩ, 0.1%, 0.125W  [FP-RG2012-IPC_B]
R47  NC (100kΩ, 0.1%, 0.125W)  [FP-RG2012-IPC_B]
U3  MAX98357AETE+T  [FP-T1633-4-IPC_B]
U4  SJ1-3513N  [SJ13513N - stubby silk]

### Ports
3V3_RAIL, MCU_BCLOCK, MCU_DOUT, MCU_LRCLOCK

### Nets
+3V3: C24.2 C25.2 R16.2 R17.2 U3.7(VDD) U3.8(VDD) ; port 3V3_RAIL
GND: C24.1 C25.1 R47.2 U3.3(GND) U3.11(GND) U3.15(GND) U3.17(EP)
NetR16_1: R16.1 U3.4(~{SD_MODE})
NetR17_1: R17.1 R47.1 U3.2(GAIN_SLOT)
NetU3_1: U3.1(DIN) ; port MCU_DOUT
NetU3_9: U3.9(OUTP) U4.2(TIP)
NetU3_10: U3.10(OUTN) U4.1(SLEEVE)
NetU3_14: U3.14(LRCLK) ; port MCU_LRCLOCK
NetU3_16: U3.16(BCLK) ; port MCU_BCLOCK

Not connected (* = marked no-connect by the designer): U3 5(NC)* 6(NC)* 12(NC)* 13(NC)*; U4 3(RING)*

### Notes on the sheet
- AUDIO PLAYBACK DAC AND AMPLIFIER IC CONNECTIONS
- MAX98357A has internal 16/24/32 bit DAC and class D power amplifier. Communication is via I2S with no MCLOCK. R17 configures gain to +3dB. R16 configures mono audio output (left/2+right/2)
- TABLE 1
- GAIN_SLOT CONNECTION
- GAIN
- (DB)
- Connect to GND through 100kΩ
- Connect to GND
- 15
- 12
- R47 resistor footprint for configuring different gains.
- Connect to VDD
- Unconnected
- 9
- 6
- AUDIO DAC AND AMPLIFIER
- TABLE 1 details the possible configurations on GAIN_SLOT pin (U3:2) to configure I2S gain in decibels.
- Connect to VDD through 100kΩ +/-5% resistor
- 3
- 1
- 5
- OLIVER CARNEW

### Library data of the parts
C24 = CMP-2000-06106-2: as C21 on sheet POWER_REV2; Digikey Description: CAP CER 10UF 16V X7R 0805; Lead Free: Yes; ComponentLink2URL: http://www.samsungsem.com/servlet/FileDownload?path=productsearch&sname=CL21B106KOQNNNE.pdf&oname=CL21B106KOQNNNE.pdf; ComponentLink2Description: Datasheet; Temperature Range Low: -55°C; RoHS: TRUE; Category: Cap; Temperature Characteristic: X7R; Manufacturer Part Number: CL21B106KOQNNNE; Automotive: No; Octopart: https://octopart.com/cl21b106koqnnne-samsung-19832289; Device Class L3: Ceramic Capacitors; Temperature Range High: +125°C; Height: 1.4mm; Device Class L2: Capacitors; Voltage Rating: 16V; Value: 10uF; Temperature: -55°C to +125°C; Tolerance: 10%; Device Class L1: Passive Components; Ipc Land Pattern Name: CAPC200125X125; Package: CL21B106KOQNNNE; Capacitance: 10uF
C25 = CL05B104KA5NNNC: Capacitor CAP CER 0.1UF 25V X7R 0402 CL05B104KA5NNNC 0402; Manufacturer_Name: SAMSUNG; Datasheet Link: https://datasheet.datasheetarchive.com/originals/distributors/DKDS-19/372989.pdf; Height: 0.55mm; Manufacturer_Part_Number: CL05B104KA5NNNC; Mouser Part Number: 187-CL05B104KA5NNNC; Mouser Price/Stock: https://www.mouser.co.uk/ProductDetail/Samsung-Electro-Mechanics/CL05B104KA5NNNC?qs=Efv9o2T6U88DLyyMSzjXSQ%3D%3D; Arrow Part Number: CL05B104KA5NNNC; Arrow Price/Stock: https://www.arrow.com/en/products/cl05b104ka5nnnc/samsung-electro-mechanics?region=nac; Parameter 1: Capacitor CAP CER 0.1UF 25V X7R 0402 CL05B104KA5NNNC
R16 = RG2012P-105-B-T5: 1 MOhms ±0.1% 0.125W, 1/8W Chip Resistor 0805 (2012 Metric) Anti-Sulfur, Automotive AEC-Q200 Thin Film; Manufacturer_Name: Susumu; Datasheet Link: https://componentsearchengine.com/Datasheets/1/RG2012P-105-B-T5.pdf; Height: 0.5mm; Manufacturer_Part_Number: RG2012P-105-B-T5; Mouser Part Number: 754-RG2012P-105-B-T5; Mouser Price/Stock: https://www.mouser.co.uk/ProductDetail/Susumu/RG2012P-105-B-T5?qs=juJhw1yPxAGByirLlL9gEQ%3D%3D; Arrow Part Number: RG2012P-105-B-T5; Arrow Price/Stock: https://www.arrow.com/en/products/rg2012p-105-b-t5/susumu?region=europe
R17 R47 = CMP-2001-02710-2: RG2012P-104-B-T5Automotive Metal Thin Film Chip Resistor, 0805, 100kΩ, 0.1%, 25ppm/°C, 0.125W, 150V; Power Rating: 125mW; Resistance: 100kR; Parameter 1: 100 kOhms ±0.1% 0.125W, 1/8W Chip Resistor 0805 (2012 Metric) Anti-Sulfur, Automotive AEC-Q200 Thin Film; Voltage Rating (DC): 150V; Tolerance: 0.1%; Lead Free: Lead Free; Features: Automotive AEC-Q200; Weight: 0.000194oz; Min Operating Temperature: -55°C; Number of Terminations: 2; Case Code (Metric): 2012; Width: 1.2mm; Max Power Dissipation: 125mW; Voltage Rating: 150V; RoHS Compliant: Yes; Length: 2mm; Series: RG; Resistor Type: Thin Film; Termination: SMD/SMT; Max Operating Temperature: 155°C; Case/Package: 0805; Temperature Coefficient: 25ppm/°C; Packaging: Tape and Reel; Case Code (Imperial): 0805; Height: 0.4mm; Size Code: 0805
U3 = CMP-05698-000018-1: IC AMP CLASS D MONO 3.2W 16TQFN; Max Supply Voltage: 5.5V; Max Output Current: 1.6A; Voltage Gain: 15dB; Max Power Dissipation: 1.666W; Min Supply Voltage: 2.5V; Power Supply Rejection Ratio (PSRR): 77dB; Series: -; Contact Plating: Tin; Min Operating Temperature: -40°C; Packaging: Tape and Reel; Max Output Power: 3.2W; Mount: Surface Mount; Number of Pins: 16; RoHS Compliant: Yes; Max Operating Temperature: 85°C; Radiation Hardening: No
U4 = SJ1-3513N: Undefined or Miscellaneous; Manufacturer_Name: Same Sky; Datasheet Link: https://www.sameskydevices.com/product/resource/sj1-351xn.pdf; Height: 6mm; Manufacturer_Part_Number: SJ1-3513N; Mouser Part Number: 490-SJ1-3513N; Mouser Price/Stock: https://www.mouser.co.uk/ProductDetail/Same-Sky/SJ1-3513N?qs=WyjlAZoYn501Uyi9N5Ym3w%3D%3D; Arrow Part Number: SJ1-3513N; Arrow Price/Stock: https://www.arrow.com/en/products/sj1-3513n/cui-devices?region=nac

## Sheet SD_CARD_REV2.SchDoc
size A4; SheetNumber: 6; SheetTotal: 11
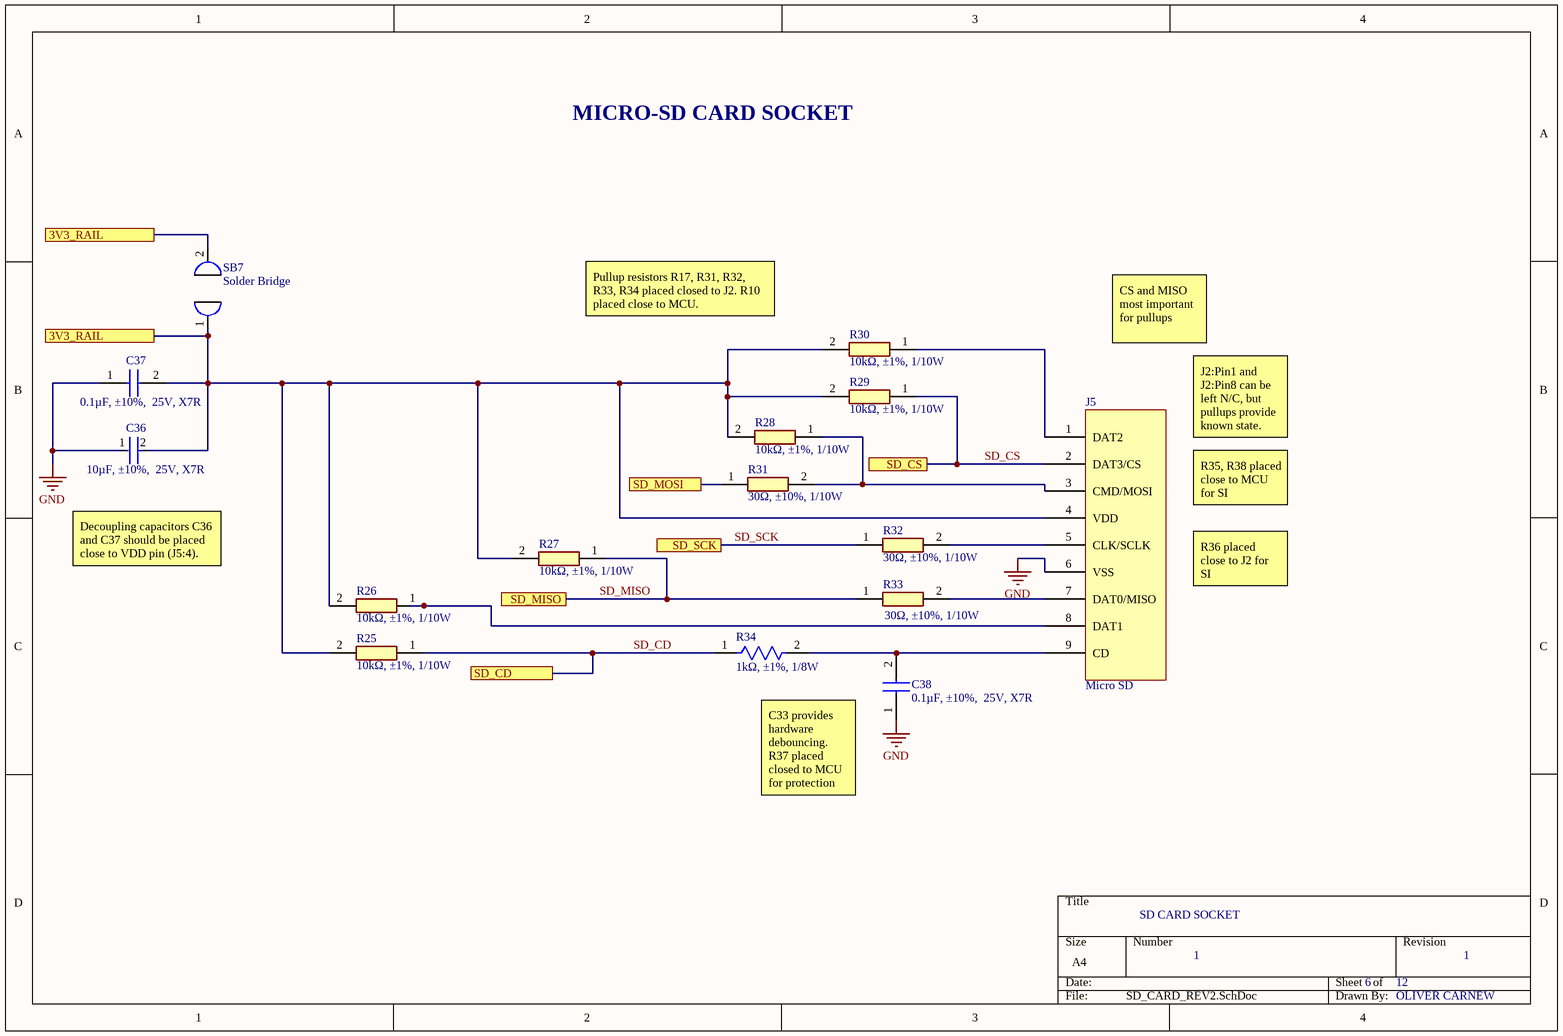
[diagram p5: SD_CARD_REV2.SchDoc]

### Parts
C36  10µF, ±10%,  25V, X7R  [FP-CL21B106KOQNNNE-MFG]
C37  0.1µF, ±10%,  25V, X7R  [CAPC1005X55N]
C38  0.1µF, ±10%,  25V, X7R  [CAPC1005X55N]
J5  Micro SD  [SD CARD]
R25  10kΩ, ±1%, 1/10W  [RESC2012X60N]
R26  10kΩ, ±1%, 1/10W  [RESC2012X60N]
R27  10kΩ, ±1%, 1/10W  [RESC2012X60N]
R28  10kΩ, ±1%, 1/10W  [RESC2012X60N]
R29  10kΩ, ±1%, 1/10W  [RESC2012X60N]
R30  10kΩ, ±1%, 1/10W  [RESC2012X60N]
R31  30Ω, ±10%, 1/10W  [RESC1608X55N]
R32  30Ω, ±10%, 1/10W  [RESC1608X55N]
R33  30Ω, ±10%, 1/10W  [RESC1608X55N]
R34  1kΩ, ±1%, 1/8W  [FP-RNCP0603-IPC_A]
SB7  Solder Bridge  [SOLDER BRIDGE OPEN SMALL]

### Ports
3V3_RAIL, SD_CD, SD_CS, SD_MISO, SD_MOSI, SD_SCK

### Nets
+3V3: C36.2 C37.2 J5.4(VDD) R25.2 R26.2 R27.2 R28.2 R29.2 R30.2 SB7.1 SB7.2 ; port 3V3_RAIL
GND: C36.1 C37.1 C38.1 J5.6(VSS)
SD_CD: R25.1 R34.1 ; port SD_CD
SD_CS: J5.2(DAT3/CS) R29.1 ; port SD_CS
SD_MISO: R27.1 R33.1 ; port SD_MISO
SD_SCK: R32.1 ; port SD_SCK
NetC38_2: C38.2 J5.9(CD) R34.2
NetJ5_1: J5.1(DAT2) R30.1
NetJ5_3: J5.3(CMD/MOSI) R28.1 R31.2
NetJ5_5: J5.5(CLK/SCLK) R32.2
NetJ5_7: J5.7(DAT0/MISO) R33.2
NetJ5_8: J5.8(DAT1) R26.1
NetR31_1: R31.1 ; port SD_MOSI

### Notes on the sheet
- MICRO-SD CARD SOCKET
- Pullup resistors R17, R31, R32, R33, R34 placed closed to J2. R10 placed close to MCU.
- CS and MISO most important for pullups
- J2:Pin1 and J2:Pin8 can be left N/C, but pullups provide known state.
- R35, R38 placed close to MCU for SI
- Decoupling capacitors C36 and C37 should be placed close to VDD pin (J5:4).
- R36 placed close to J2 for SI
- C33 provides hardware debouncing. R37 placed closed to MCU for protection
- SD CARD SOCKET
- 1
- 6
- 12
- OLIVER CARNEW

### Library data of the parts
C36 = CMP-2000-06106-2: as C21 on sheet POWER_REV2; Digikey Description: CAP CER 10UF 16V X7R 0805; Lead Free: Yes; ComponentLink2URL: http://www.samsungsem.com/servlet/FileDownload?path=productsearch&sname=CL21B106KOQNNNE.pdf&oname=CL21B106KOQNNNE.pdf; ComponentLink2Description: Datasheet; Temperature Range Low: -55°C; RoHS: TRUE; Category: Cap; Temperature Characteristic: X7R; Manufacturer Part Number: CL21B106KOQNNNE; Automotive: No; Octopart: https://octopart.com/cl21b106koqnnne-samsung-19832289; Device Class L3: Ceramic Capacitors; Temperature Range High: +125°C; Height: 1.4mm; Device Class L2: Capacitors; Voltage Rating: 16V; Value: 10uF; Temperature: -55°C to +125°C; Tolerance: 10%; Device Class L1: Passive Components; Ipc Land Pattern Name: CAPC200125X125; Package: CL21B106KOQNNNE; Capacitance: 10uF
C37 C38 = CL05B104KA5NNNC: as C26 on sheet MCU_REV2; Datasheet Link: https://datasheet.datasheetarchive.com/originals/distributors/DKDS-19/372989.pdf; Height: 0.55mm; Manufacturer_Part_Number: CL05B104KA5NNNC; Mouser Part Number: 187-CL05B104KA5NNNC; Mouser Price/Stock: https://www.mouser.co.uk/ProductDetail/Samsung-Electro-Mechanics/CL05B104KA5NNNC?qs=Efv9o2T6U88DLyyMSzjXSQ%3D%3D; Arrow Part Number: CL05B104KA5NNNC; Arrow Price/Stock: https://www.arrow.com/en/products/cl05b104ka5nnnc/samsung-electro-mechanics?region=nac; Parameter 1: Capacitor CAP CER 0.1UF 25V X7R 0402 CL05B104KA5NNNC
J5 = SD_CARD_MICRO: ETSG
R25-R30 = RC0805JR-0710KL: as R24 on sheet MCU_REV2; Datasheet Link: https://componentsearchengine.com/Datasheets/2/RC0805JR-0710KL.pdf; Height: 0.6mm; Manufacturer_Part_Number: RC0805JR-0710KL; Mouser Part Number: 603-RC0805JR-0710KL; Mouser Price/Stock: https://www.mouser.co.uk/ProductDetail/YAGEO/RC0805JR-0710KL?qs=ZFGQJeMQzF5q%2Fp77vM%2FrVQ%3D%3D; Arrow Part Number: RC0805JR-0710KL; Arrow Price/Stock: https://www.arrow.com/en/products/rc0805jr-0710kl/yageo?region=nac
R31-R33 = ERJPA3F30R0V: as R18 on sheet MCU_REV2; Datasheet Link: https://industrial.panasonic.com/cdbs/www-data/pdf/RDA0000/AOA0000C243.pdf; Height: 0.55mm; Manufacturer_Part_Number: ERJPA3F30R0V; Arrow Part Number: ERJPA3F30R0V; Arrow Price/Stock: https://www.arrow.com/en/products/erj-pa3f30r0v/panasonic; Parameter 1: Resistor ERJPA3F30R0V 30 Ohms ±1% 0.333W, 1/3W Chip Resistor 0603 (1608 Metric) Automotive AEC-Q200, Pulse Withstanding Thick Film
R34 = CMP-26527-006179-1: 1kΩ ±1% 0.125W 0603 High Power Anti-Sulfur Thin Film Chip Resistor RNCP0603FTD1K00; Temperature Coefficient: 100ppm/°C; Max Power Dissipation: 125mW; Resistance: 1kR; Case/Package: 0603; Width: 0.031inch; Tolerance: 1%; Case Code (Imperial): 0603; RoHS Compliant: Yes; Min Operating Temperature: -55°C; Resistor Type: Thin Film; Features: Moisture Resistant; Length: 0.059inch; Mount: Surface Mount; Case Code (Metric): 1608; Height: 0.02inch; Max Operating Temperature: 155°C; Packaging: Tape and Reel; Series: RNCP; Number of Terminations: 2
SB7 = SOLDER_BRIDGE_TDROP: Tension Fill Solder Bridge